# EAGLE schematic LimitSwitch_opto (EAGLE 8.0.1)
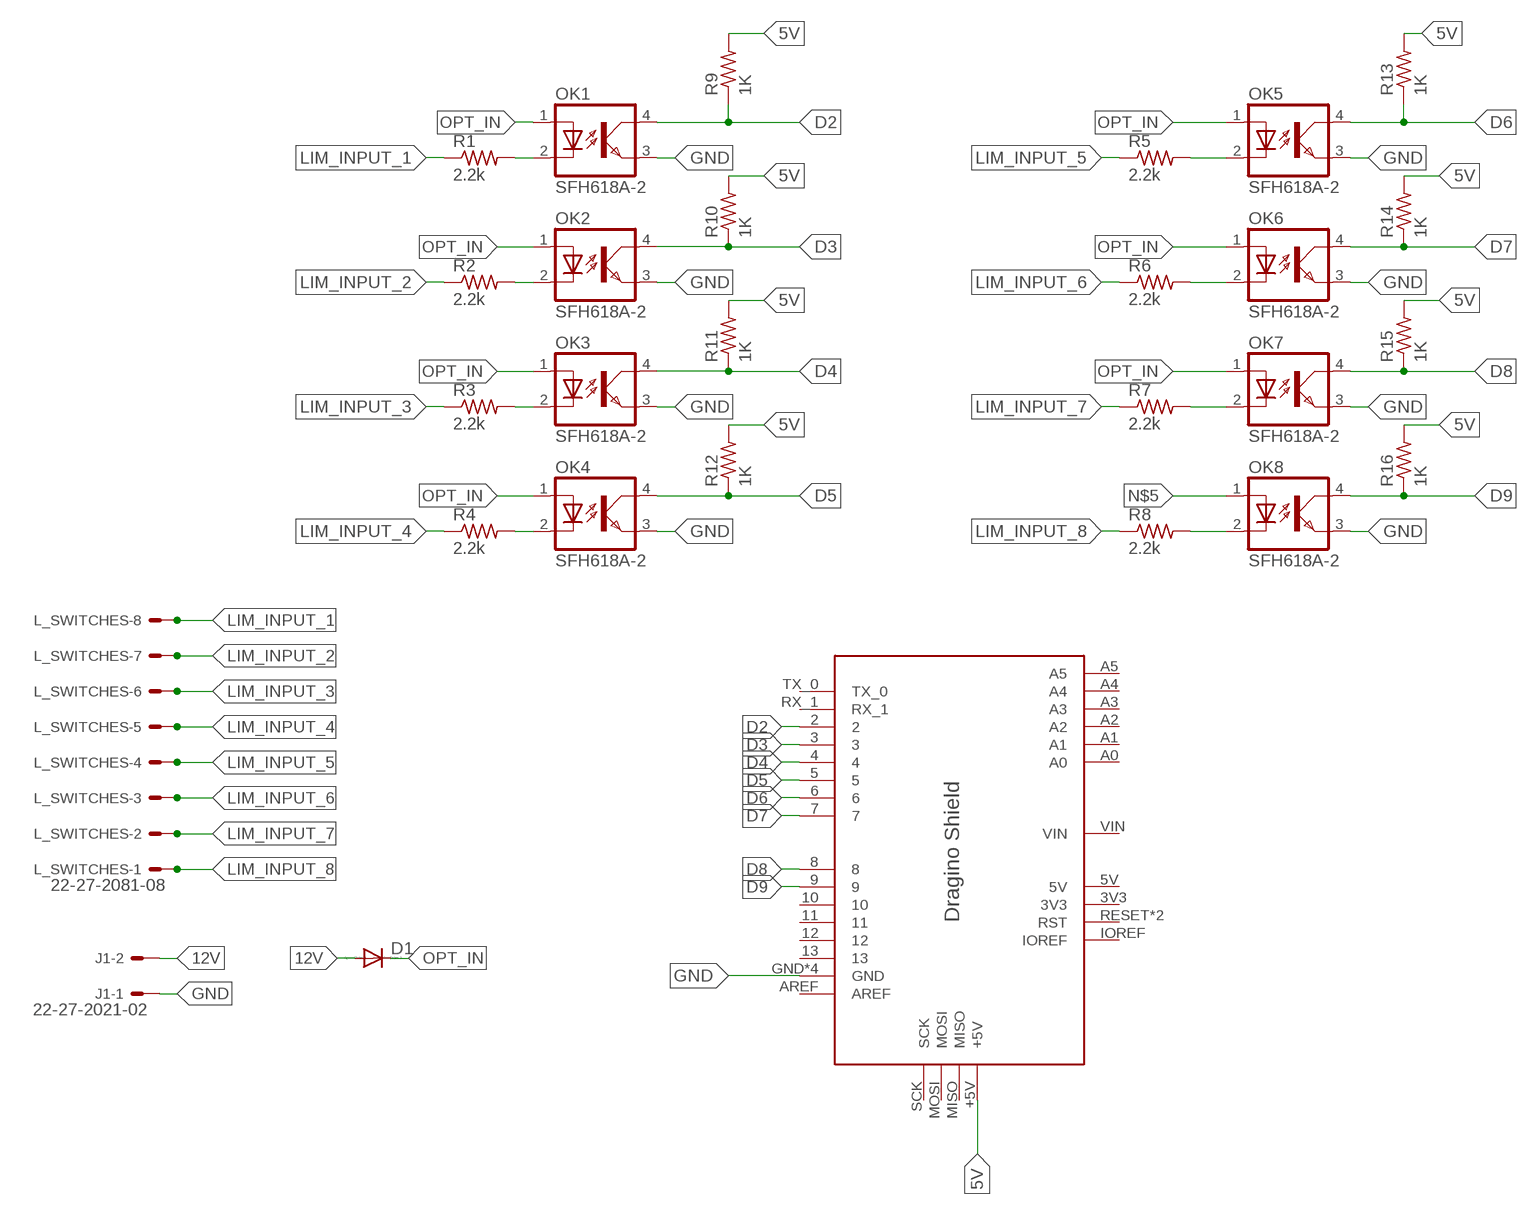
[diagram p0: schematic, sheet 1]

## Parts
D1  1N4004  [DO41-10]
J1  22-27-2021-02  [6410-02]
L_SWITCHES  22-27-2081-08  [6410-08]
OK1  SFH618A-2  [DIP4]
OK2  SFH618A-2  [DIP4]
OK3  SFH618A-2  [DIP4]
OK4  SFH618A-2  [DIP4]
OK5  SFH618A-2  [DIP4]
OK6  SFH618A-2  [DIP4]
OK7  SFH618A-2  [DIP4]
OK8  SFH618A-2  [DIP4]
R1  2.2k  R-US_0204/2V  [0204V]
R2  2.2k  R-US_0204/2V  [0204V]
R3  2.2k  R-US_0204/2V  [0204V]
R4  2.2k  R-US_0204/2V  [0204V]
R5  2.2k  R-US_0204/2V  [0204V]
R6  2.2k  R-US_0204/2V  [0204V]
R7  2.2k  R-US_0204/2V  [0204V]
R8  2.2k  R-US_0204/2V  [0204V]
R9  1K  R-US_0204/2V  [0204V]
R10  1K  R-US_0204/2V  [0204V]
R11  1K  R-US_0204/2V  [0204V]
R12  1K  R-US_0204/2V  [0204V]
R13  1K  R-US_0204/2V  [0204V]
R14  1K  R-US_0204/2V  [0204V]
R15  1K  R-US_0204/2V  [0204V]
R16  1K  R-US_0204/2V  [0204V]
U$1  DRAGINO_SHIELD  [DRAGINO_SHIELD]

## Nets
5V: R9.2 R10.2 R11.2 R12.2 R13.2 R14.2 R15.2 R16.2 U$1.+5V
12V: D1.A J1.2
D2: OK1.4(COL) R9.1 U$1.2
D3: OK2.4(COL) R10.1 U$1.3
D4: OK3.4(COL) R11.1 U$1.4
D5: OK4.4(COL) R12.1 U$1.5
D6: OK5.4(COL) R13.1 U$1.6
D7: OK6.4(COL) R14.1 U$1.7
D8: OK7.4(COL) R15.1 U$1.8
D9: OK8.4(COL) R16.1 U$1.9
GND: J1.1 OK1.3(EMIT) OK2.3(EMIT) OK3.3(EMIT) OK4.3(EMIT) OK5.3(EMIT) OK6.3(EMIT) OK7.3(EMIT) OK8.3(EMIT) U$1.GND U$1.GND@1(GND) U$1.GND@2(GND) U$1.GND@3(GND)
LIM_INPUT_1: L_SWITCHES.8 R1.1
LIM_INPUT_2: L_SWITCHES.7 R2.1
LIM_INPUT_3: L_SWITCHES.6 R3.1
LIM_INPUT_4: L_SWITCHES.5 R4.1
LIM_INPUT_5: L_SWITCHES.4 R5.1
LIM_INPUT_6: L_SWITCHES.3 R6.1
LIM_INPUT_7: L_SWITCHES.2 R7.1
LIM_INPUT_8: L_SWITCHES.1 R8.1
N$5: OK8.1(A)
N$9: OK1.2(C) R1.2
N$10: OK2.2(C) R2.2
N$11: OK3.2(C) R3.2
N$12: OK4.2(C) R4.2
N$13: OK5.2(C) R5.2
N$14: OK6.2(C) R6.2
N$15: OK7.2(C) R7.2
N$16: OK8.2(C) R8.2
OPT_IN: D1.C OK1.1(A) OK2.1(A) OK3.1(A) OK4.1(A) OK5.1(A) OK6.1(A) OK7.1(A)
Unconnected: U$1.3V3 U$1.5V U$1.10 U$1.11 U$1.12 U$1.13 U$1.A0 U$1.A1 U$1.A2 U$1.A3 U$1.A4 U$1.A5 U$1.AREF U$1.IOREF U$1.MISO U$1.MOSI U$1.RESET(RST) U$1.RST U$1.RX_1 U$1.SCK U$1.TX_0 U$1.VIN

## Library data of the parts
D1 = diode:1N4004: DIODE general purpose rectifier, 1 A
J1 = con-molex:22-?-02: CONNECTOR wire to board 2.54 mm (.1 inch) pitch header; OC_FARNELL: unknown; OC_NEWARK: unknown
L_SWITCHES = con-molex:22-?-08: CONNECTOR wire to board 2.54 mm (.1 inch) pitch header; OC_FARNELL: unknown; OC_NEWARK: unknown
OK1-OK8 = optocoupler:SFH618?*: Optocoupler, Phototransistor Output, Low Input Current Source: Data sheet <http://www.vishay.com/docs/83673/sfh618.pdf>; MF: VISHAY/TELEFUNKEN; MPN: SFH618A-2; OC_FARNELL: 6424855; OC_NEWARK: 21H7744
R1-R16 = rcl:R-US_: RESISTOR, American symbol
U$1 = Dragino_shield:DRAGINO_SHIELD